# Altium schematic sheet POWER_PMIC.SchDoc
size B
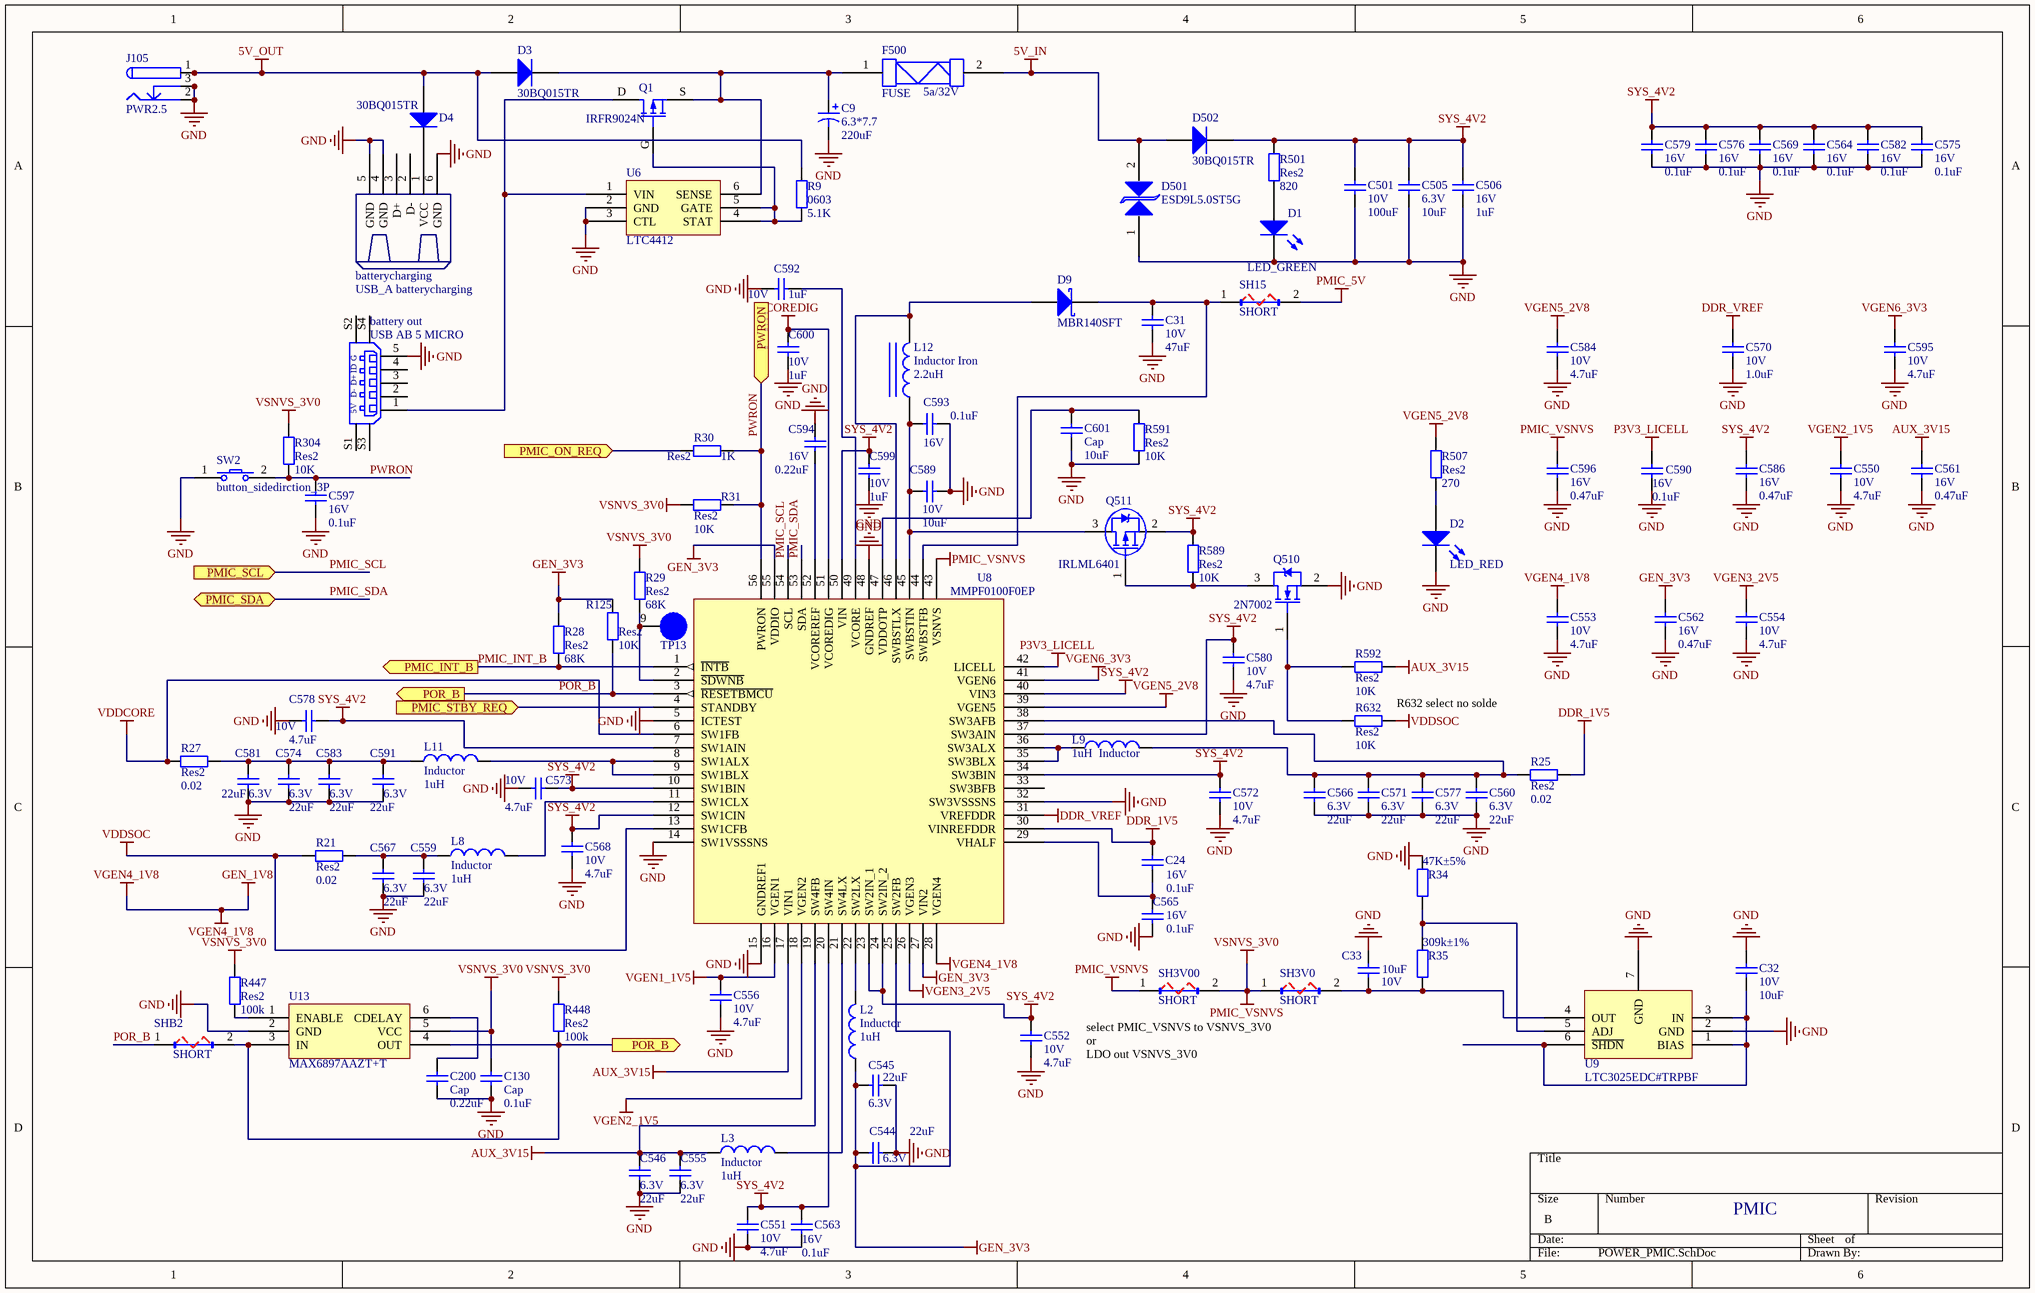
[diagram p0: POWER_PMIC.SchDoc]

## Parts
battery_out  USB AB 5 MICRO  [micro-USB-port]
batterycharging  USB_A batterycharging  [USB_A]
C9  6.3*7.7  value 220uF  [SMD Electrolytic Capacitors 6.3 X 7.7]
C24  16V  value 0.1uF  [0402]
C31  10V  value 47uF  [nonpolarity_cap_1206]
C32  10V  value 10uF  [0603]
C33  10V  value 10uF  [0603]
C130  Cap  value 0.1uF  [0603]
C200  Cap  value 0.22uF  [0603]
C501  10V  value 100uF  [nonpolarity_cap_1206]
C505  6.3V  value 10uF  [0603]
C506  16V  value 1uF  [0603]
C544  6.3V  value 22uF  [0603]
C545  6.3V  value 22uF  [0603]
C546  6.3V  value 22uF  [0603]
C550  10V  value 4.7uF  [0603]
C551  10V  value 4.7uF  [0603]
C552  10V  value 4.7uF  [0603]
C553  10V  value 4.7uF  [0603]
C554  10V  value 4.7uF  [0603]
C555  6.3V  value 22uF  [0603]
C556  10V  value 4.7uF  [0603]
C559  6.3V  value 22uF  [0603]
C560  6.3V  value 22uF  [0603]
C561  16V  value 0.47uF  [0402]
C562  16V  value 0.47uF  [0402]
C563  16V  value 0.1uF  [0402]
C564  16V  value 0.1uF  [0402]
C565  16V  value 0.1uF  [0402]
C566  6.3V  value 22uF  [0603]
C567  6.3V  value 22uF  [0603]
C568  10V  value 4.7uF  [0603]
C569  16V  value 0.1uF  [0402]
C570  10V  value 1.0uF  [0402]
C571  6.3V  value 22uF  [0603]
C572  10V  value 4.7uF  [0603]
C573  10V  value 4.7uF  [0603]
C574  6.3V  value 22uF  [0603]
C575  16V  value 0.1uF  [0402]
C576  16V  value 0.1uF  [0402]
C577  6.3V  value 22uF  [0603]
C578  10V  value 4.7uF  [0603]
C579  16V  value 0.1uF  [0402]
C580  10V  value 4.7uF  [0603]
C581  6.3V  value 22uF  [0603]
C582  16V  value 0.1uF  [0402]
C583  6.3V  value 22uF  [0603]
C584  10V  value 4.7uF  [0603]
C586  16V  value 0.47uF  [0603]
C589  10V  value 10uF  [0603]
C590  16V  value 0.1uF  [0402]
C591  6.3V  value 22uF  [0603]
C592  10V  value 1uF  [0402]
C593  16V  value 0.1uF  [0402]
C594  16V  value 0.22uF  [0402]
C595  10V  value 4.7uF  [0603]
C596  16V  value 0.47uF  [0402]
C597  16V  value 0.1uF  [0402]
C599  10V  value 1uF  [0402]
C600  10V  value 1uF  [0402]
C601  Cap  value 10uF  [0603]
D1  LED_GREEN  [LED_0603]
D2  LED_RED  [LED_0603]
D3  30BQ015TR  [SMLJ60S6-TP-DO214AB]
D4  30BQ015TR  [SMLJ60S6-TP-DO214AB]
D9  MBR140SFT  [MBR140SFT-SOD123]
D501  ESD9L5.0ST5G  [ESD9L5.0ST5G-SOD923]
D502  30BQ015TR  [SMLJ60S6-TP-DO214AB]
F500  FUSE  [FUSE FAST 5A]
J105  PWR2.5  [KLD-0202]
L2  Inductor  value 1uH  [VLS252010T-1R0N]
L3  Inductor  value 1uH  [VLS252010T-1R0N]
L8  Inductor  value 1uH  [VLS252010T-1R0N]
L9  Inductor  value 1uH  [LPS5015-102MLC-SMT]
L11  Inductor  value 1uH  [LPS5015-102MLC-SMT]
L12  Inductor Iron  value 2.2uH  [LPS4018-222MLC]
Q1  IRFR9024N  [IRFR/U9024N_TO-252AA]
Q510  2N7002  [2N7002]
Q511  IRLML6401  [IRLML6401]
R9  0603  value 5.1K  [0603]
R21  Res2  value 0.02  [0805]
R25  Res2  value 0.02  [0805]
R27  Res2  value 0.02  [0805]
R28  Res2  value 68K  [0402]
R29  Res2  value 68K  [0402]
R30  Res2  value 1K  [0201]
R31  Res2  value 10K  [0402]
R34  value 47K±5%  [0402]  (hidden comment: Res2)
R35  value 309k±1%  [0402]  (hidden comment: Res2)
R125  Res2  value 10K  [0402]
R304  Res2  value 10K  [0402]
R447  Res2  value 100k  [0603]
R448  Res2  value 100k  [0603]
R501  Res2  value 820  [0402]
R507  Res2  value 270  [0402]
R589  Res2  value 10K  [0402]
R591  Res2  value 10K  [0402]
R592  Res2  value 10K  [0402]
R632  Res2  value 10K  [0402]
SH3V0  SHORT  [SHORT_SH]
SH3V00  SHORT  [SHORT_SH]
SH15  SHORT  [SHORT_SH]
SHB2  SHORT  [SHORT_SH]
SW2  button_sidedirction_3P  [button_sidedirction_3P 4.5X4.5]
TP13  TP test  [TP]  (value not drawn)
U6  LTC4412  [LTC4412-TSOT-23]
U8  MMPF0100F0EP  [MMP0100F0AEP]
U9  LTC3025EDC#TRPBF  [LTC3025]
U13  MAX6897AAZT+T  [MAX6897-SOT23-6]

## Ports
PMIC_INT_B (out), PMIC_ON_REQ (in), PMIC_SCL (in), PMIC_SDA, PMIC_STBY_REQ (in), POR_B (out), PWRON (in)

## Nets
5V_IN: D501.2(VSS5) D502.A F500.2(DSI_REXT)
5V_OUT: D3.A D4.A J105.1 J105.1A J105.1B R9.1
AUX_3V15: C546.1 C555.1 C561.1 L3.1 R592.2 U8.17(VIN1) U8.19(SW4FB)
DDR_1V5: C24.2 R25.2 U8.30(VINREFDDR)
DDR_VREF: C570.2 U8.31(VREFDDR)
GEN_1V8: C553.2 U8.28(VGEN4)  [also labelled VGEN4_1V8]
GEN_3V3: C544.2 C545.2 C562.1 L2.1 R28.2 R125.2 U8.25(SW2FB) U8.27(VIN2) U8.55(VDDIO)
GND: battery_out.5(GND) batterycharging.4(GND) batterycharging.5(GND) batterycharging.6(GND) C9.2 C31.1 C32.2 C33.1 C130.1 C200.2 C501.1 C505.1 C506.1 C544.1 C545.1 C546.2 C550.1 C551.2 C552.1 C553.1 C554.1 C555.2 C556.2 C559.1 C560.1 C561.2 C562.2 C563.1 C564.1 C565.1 C566.1 C567.1 C568.1 C569.1 C570.1 C571.1 C572.2 C573.1 C574.1 C575.1 C576.1 C577.1 C578.1 C579.1 C580.2 C581.1 C582.1 C583.1 C584.1 C586.1 C589.2 C590.1 C591.1 C592.2 C593.2 C594.1 C595.1 C596.1 C597.1 C599.1 C600.1 C601.1 D1.2(K) D2.2(K) D501.1(VSS6) J105.2 J105.2A J105.2B J105.3 J105.3A J105.3B Q510.2(S) R34.2 R591.1 SW2.1 U6.2(GND) U6.3(CTL) U8.5(ICTEST) U8.14(SW1VSSSNS) U8.15(GNDREF1) U8.32(SW3VSSSNS) U8.48(GNDREF) U9.2(GND) U9.7(GND) U13.2(GND)
P3V3_LICELL: C590.2 U8.42(LICELL)
PMIC_5V: SH15.2(VCCIO)
PMIC_VSNVS: C130.2 C596.2 R29.2 R31.1 R304.2 R447.2 R448.2 SH3V0.1(VCCIO) SH3V00.1(VCCIO) SH3V00.2(VCCIO) U8.43(VSNVS) U13.5(VCC)  [also labelled VSNVS_3V0]
SYS_4V2: C501.2 C505.2 C506.2 C551.1 C552.2 C563.2 C564.2 C568.2 C569.2 C572.1 C573.2 C575.2 C576.2 C578.2 C579.2 C580.1 C582.2 C586.2 C599.2 D502.B(K) Q511.2(S) R501.1 R589.2 U8.7(SW1AIN) U8.10(SW1BIN) U8.12(SW1CIN) U8.20(SW4IN) U8.23(SW2IN_1) U8.24(SW2IN_2) U8.34(SW3BIN) U8.37(SW3AIN) U8.40(VIN3) U8.50(VIN)
VCOREDIG: C600.2 U8.51(VCOREDIG)
VDDCORE: R27.1 U8.6(SW1FB)
VDDSOC: R21.1 R632.2 U8.13(SW1CFB)
VGEN1_1V5: C556.1 U8.16(VGEN1)
VGEN2_1V5: C550.2 U8.18(VGEN2)
VGEN3_2V5: C554.2 U8.26(VGEN3)
VGEN5_2V8: C584.2 R507.2 U8.39(VGEN5)
VGEN6_3V3: C595.2 U8.41(VGEN6)
PMIC_INT_B: R28.1 U8.1(~{INTB}) ; port PMIC_INT_B
PMIC_ON_REQ: R30.2 ; port PMIC_ON_REQ
PMIC_SCL: U8.54(SCL) ; port PMIC_SCL
PMIC_SDA: U8.53(SDA) ; port PMIC_SDA
PMIC_STBY_REQ: U8.4(STANDBY) ; port PMIC_STBY_REQ
POR_B: R125.1 R448.1 SHB2.1(VCCIO) SHB2.2(VCCIO) U8.3(~{RESETBMCU}) U13.3(IN) U13.4(OUT) ; port POR_B
PWRON: C597.2 R30.1 R31.2 R304.1 SW2.2 U8.56(PWRON) ; port PWRON
Netbattery_out_1: battery_out.1(GND) Q1.D U6.1(VIN)
Netbatterycharging_1: batterycharging.1(VCC) D4.B(K)
NetC9_1: C9.1 D3.B(K) F500.1(DSI_REXT) Q1.S U6.6(SENSE)
NetC24_1: C24.1 C565.2 U8.29(VHALF)
NetC31_2: C31.2 D9.2(K) SH15.1(VCCIO) U8.44(SWBSTFB)
NetC32_1: C32.1 U9.1(BIAS) U9.3(IN) U9.6(~{SHDN})
NetC33_2: C33.2 R35.1 SH3V0.2(VCCIO) U9.4(OUT)
NetC200_1: C200.1 U13.6(CDELAY)
NetC559_2: C559.2 C567.2 L8.1 R21.2
NetC560_2: C560.2 C566.2 C571.2 C577.2 L9.2 R25.1 U8.38(SW3AFB)
NetC574_2: C574.2 C581.2 C583.2 C591.2 L11.1 R27.2
NetC589_1: C589.1 C593.1 L12.1 Q511.3(D) U8.45(SWBSTIN)
NetC592_1: C592.1 U8.49(VCORE)
NetC594_2: C594.2 U8.52(VCOREREF)
NetC601_2: C601.2 R591.2 U8.47(VDDOTP)
NetD1_1: D1.1(A) R501.2
NetD2_1: D2.1(A) R507.1
NetD9_1: D9.1(A) L12.2 U8.46(SWBSTLX)
NetL2_2: L2.2 U8.22(SW2LX)
NetL3_2: L3.2 U8.21(SW4LX)
NetL8_2: L8.2 U8.11(SW1CLX)
NetL9_1: L9.1 U8.35(SW3BLX) U8.36(SW3ALX)
NetL11_2: L11.2 U8.8(SW1ALX) U8.9(SW1BLX)
NetQ1_G: Q1.G R9.2 U6.4(STAT) U6.5(GATE)
NetQ510_1: Q510.1(G) R592.1 R632.1
NetQ510_3: Q510.3(D) Q511.1(G) R589.1
NetR29_1: R29.1 TP13.9(S) U8.2(~{SDWNB})
NetR34_1: R34.1 R35.2 U9.5(ADJ)
NetR447_1: R447.1 U13.1(ENABLE)

Not connected (* = marked no-connect by the designer): battery_out 2(GND) 3(GND) 4(GND) S1(6) S2(7) S3(8) S4(9); batterycharging 2(D-) 3(D+); U8 33(SW3BFB)

## Notes on the sheet
- R632 select no solde
- select PMIC_VSNVS to VSNVS_3V0
  or
  LDO out VSNVS_3V0
- PMIC
- (in symbol FUSE) 5a/32V
- (in symbol USB AB 5 MICRO) G; ID; D+; D-; 5V

## Library data of the parts
batterycharging = USB_A
C9 = Cap Pol1: Polarized Capacitor (Radial); Published: 8-Jun-2000; LatestRevisionDate: 17-Jul-2002; LatestRevisionNote: Re-released for DXP Platform.; PackageReference: RB7.6-15; Publisher: Altium Limited
C24 C31-C33 C130 C200 C501 C505 C506 C544-C546 C550-C556 C559-C584 C586 C589-C597 C599-C601 = Cap: Capacitor; Published: 8-Jun-2000; LatestRevisionDate: 17-Jul-2002; LatestRevisionNote: Re-released for DXP Platform.; PackageReference: RAD-0.3; Publisher: Altium Limited
D1 D2 = LED0: Typical INFRARED GaAs LED; Published: 8-Jun-2000; LatestRevisionDate: 08-Jul-2005; LatestRevisionNote: Mech Layer 1 removed.; PackageReference: LED-0; Publisher: Altium Limited
D3 D4 D502 = SMLJ60S6-TP
D9 = Diode 11DQ03: Schottky Rectifier; Published: 8-Jun-2000; LatestRevisionDate: 17-Jul-2002; LatestRevisionNote: Re-released for DXP Platform.; DatasheetVersion: Dec-1997; PackageReference: DO-204AL; Publisher: Altium Limited; Code_JEDEC: DO-204-AL; ComponentLink1Description: Manufacturer Link; ComponentLink1URL: http://www.irf.com/; ComponentLink2Description: Datasheet; ComponentLink2URL: http://www.irf.com/product-info/datasheets/data/11dq03.pdf
D501 = DIODE TVS
J105 = PWR2.5: Low Voltage Power Supply Connector; Published: 17-Dec-2003; DatasheetDocument: 09-May-2002; Publisher: Altium Limited; ComponentLink1Description: Manufacturer Link; ComponentLink1URL: http://domino.kycon.com/internet/Products.html
L2 L3 L8 L9 L11 = Inductor: Code_IEC: 1005; Published: 8-Jun-2000; LatestRevisionDate: 29-May-2009; LatestRevisionNote: IPC-7351 Footprint Added.; PackageReference: 0402-A; Publisher: Altium Limited; PackageDescription: Chip Inductor; Code_JEITA: 0402
L12 = Inductor Iron: Magnetic-Core Inductor; Published: 24-Mar-1999; LatestRevisionDate: 17-Jul-2002; LatestRevisionNote: Re-released for DXP Platform.; PackageReference: AXIAL-0.9; Publisher: Altium Limited
Q1 = IRFR/U9024N
R9 R21 R25 R27-R31 R34 R35 R125 R304 R447 R448 R501 R507 R589 R591 R592 R632 = Res2: Resistor; Published: 8-Jun-2000; LatestRevisionDate: 17-Jul-2002; LatestRevisionNote: Re-released for DXP Platform.; PackageReference: AXIAL-0.4; Publisher: Altium Limited
SH3V0 SH3V00 SH15 SHB2 = SOLDER SHORT
U9 = LTC3025